# EAGLE design hot-plate_PID_v1.0 (EAGLE 6.2)

## Sheet 1 of 4
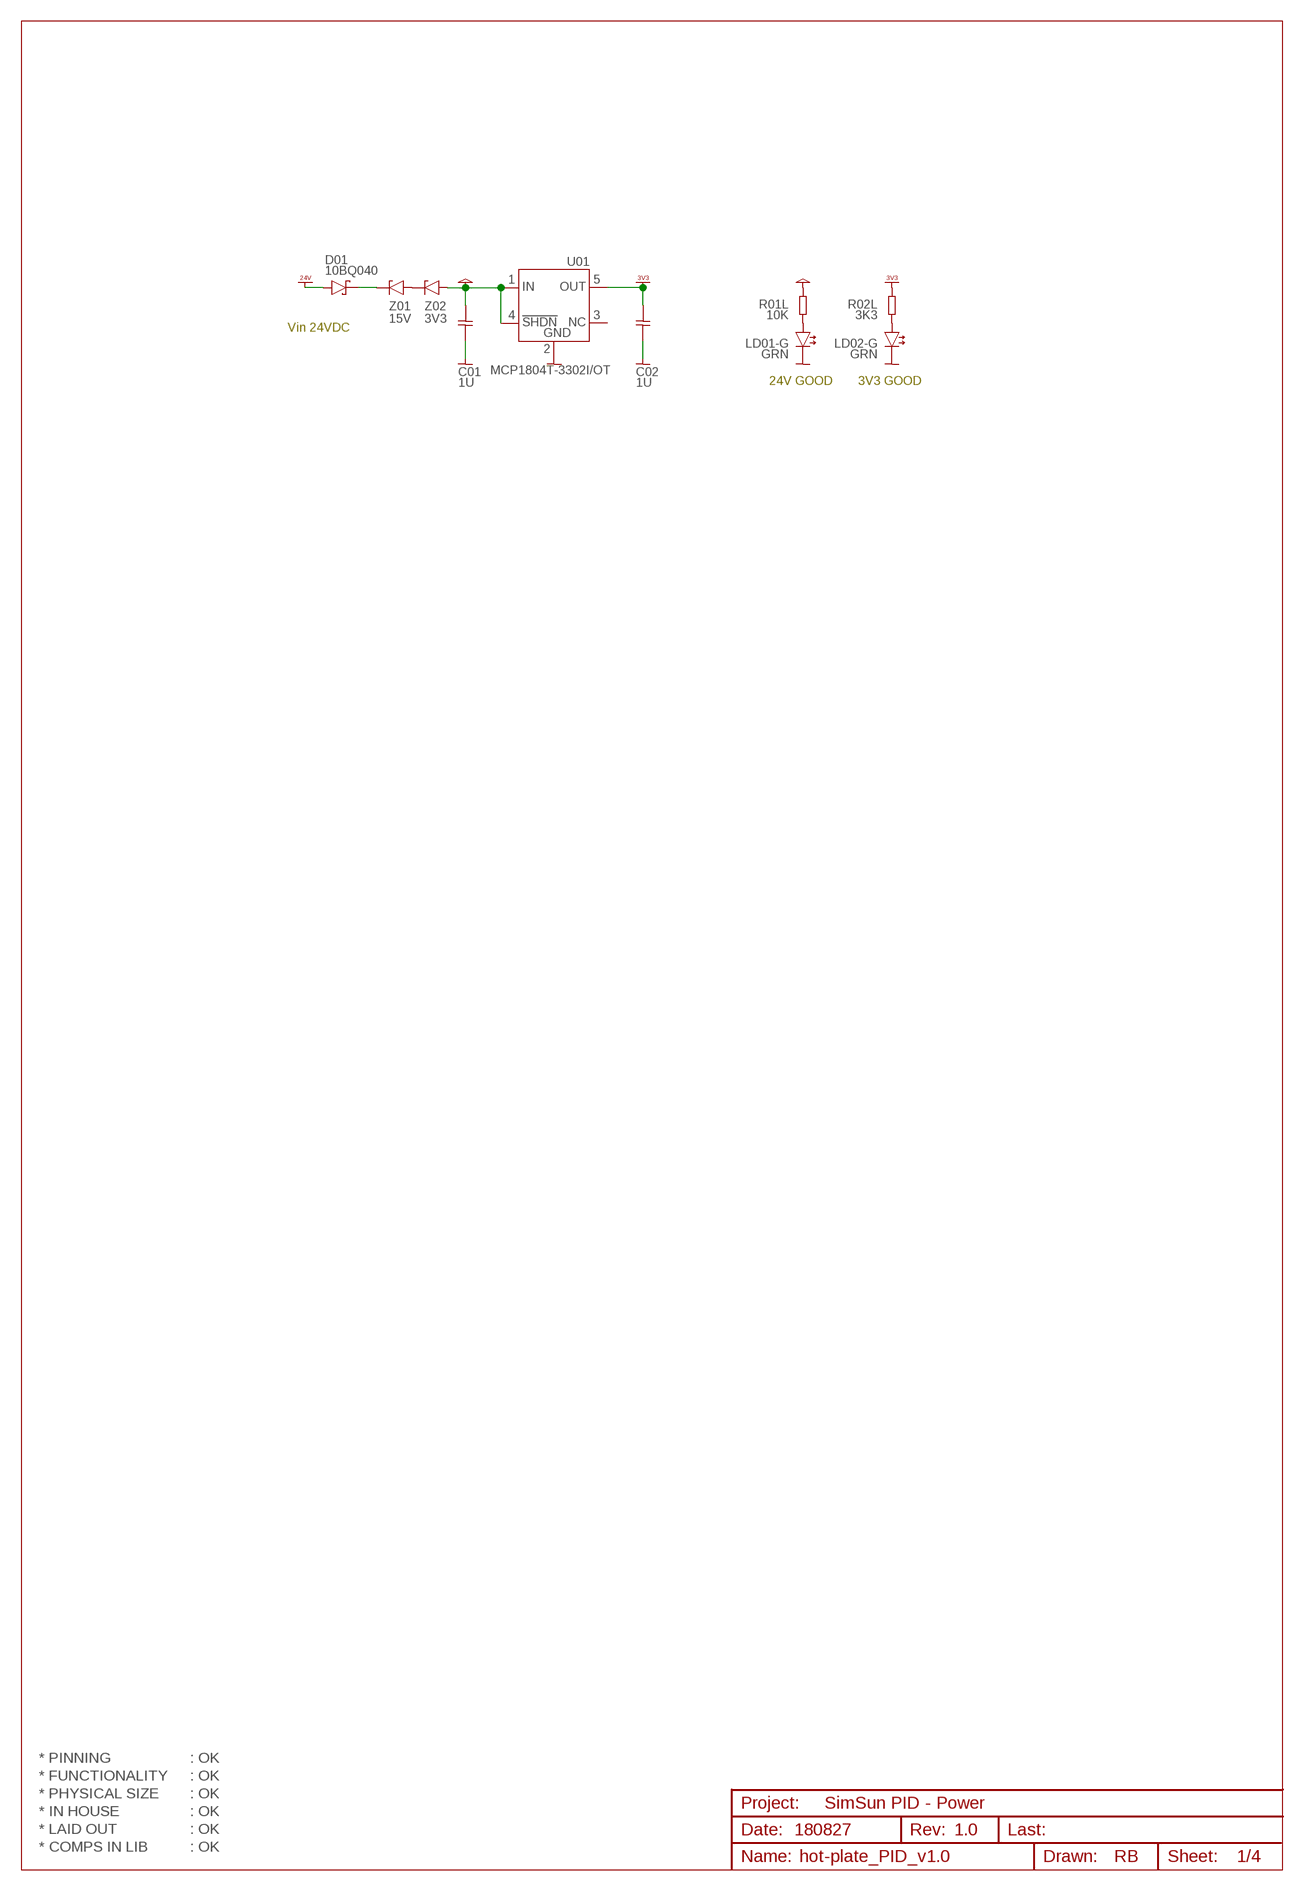
[diagram p0: schematic, sheet 1]

### Parts
C01  1U  CAP0603  [CAP0603]
C02  1U  CAP0603  [CAP0603]
D01  10BQ040  DIODE_15MQ040  [DIODE_SMA]
LD01-G  GRN  LED_SMD_0603  [LED_SMD_0603]
LD02-G  GRN  LED_SMD_0603  [LED_SMD_0603]
R01L  10K  RES0603  [RES0603]
R02L  3K3  RES0603  [RES0603]
U01  MCP1804T-3302I/OT  [SOT23-5]
Z01  15V  ZENER_SOD80  [ZENER_SOD80]
Z02  3V3  ZENER_SOD80  [ZENER_SOD80]

### Nets
GND: C01.2 C02.2 LD01-G.C LD02-G.C U01.2(2.GND) ; also sheet 2,3,4
N$3: LD02-G.A R02L.2
N$25: LD01-G.A R01L.2
N$151: D01.C(-) Z01.2(-)
N$162: Z01.1(+) Z02.2(-)
VCC: C01.1 R01L.1 U01.1(1.IN) U01.4(4.SHDN) Z02.1(+)
VDD_3V3: C02.1 R02L.1 U01.5(5.OUT) ; supply symbol labelled VCC_3V3 ; also sheet 2,4
VDD_24V: D01.A(+) ; supply symbol labelled VCC_24V ; also sheet 2,3
Unconnected: U01.3(3.NC)

### Notes on the sheet
- Vin 24VDC
- 24V GOOD | 3V3 GOOD
- * PINNING | : OK
- * FUNCTIONALITY | : OK
- * PHYSICAL SIZE | : OK
- SimSun PID - Power
- * IN HOUSE | : OK
- * LAID OUT | : OK | 180827 | 1.0
- * COMPS IN LIB | : OK

## Sheet 2 of 4
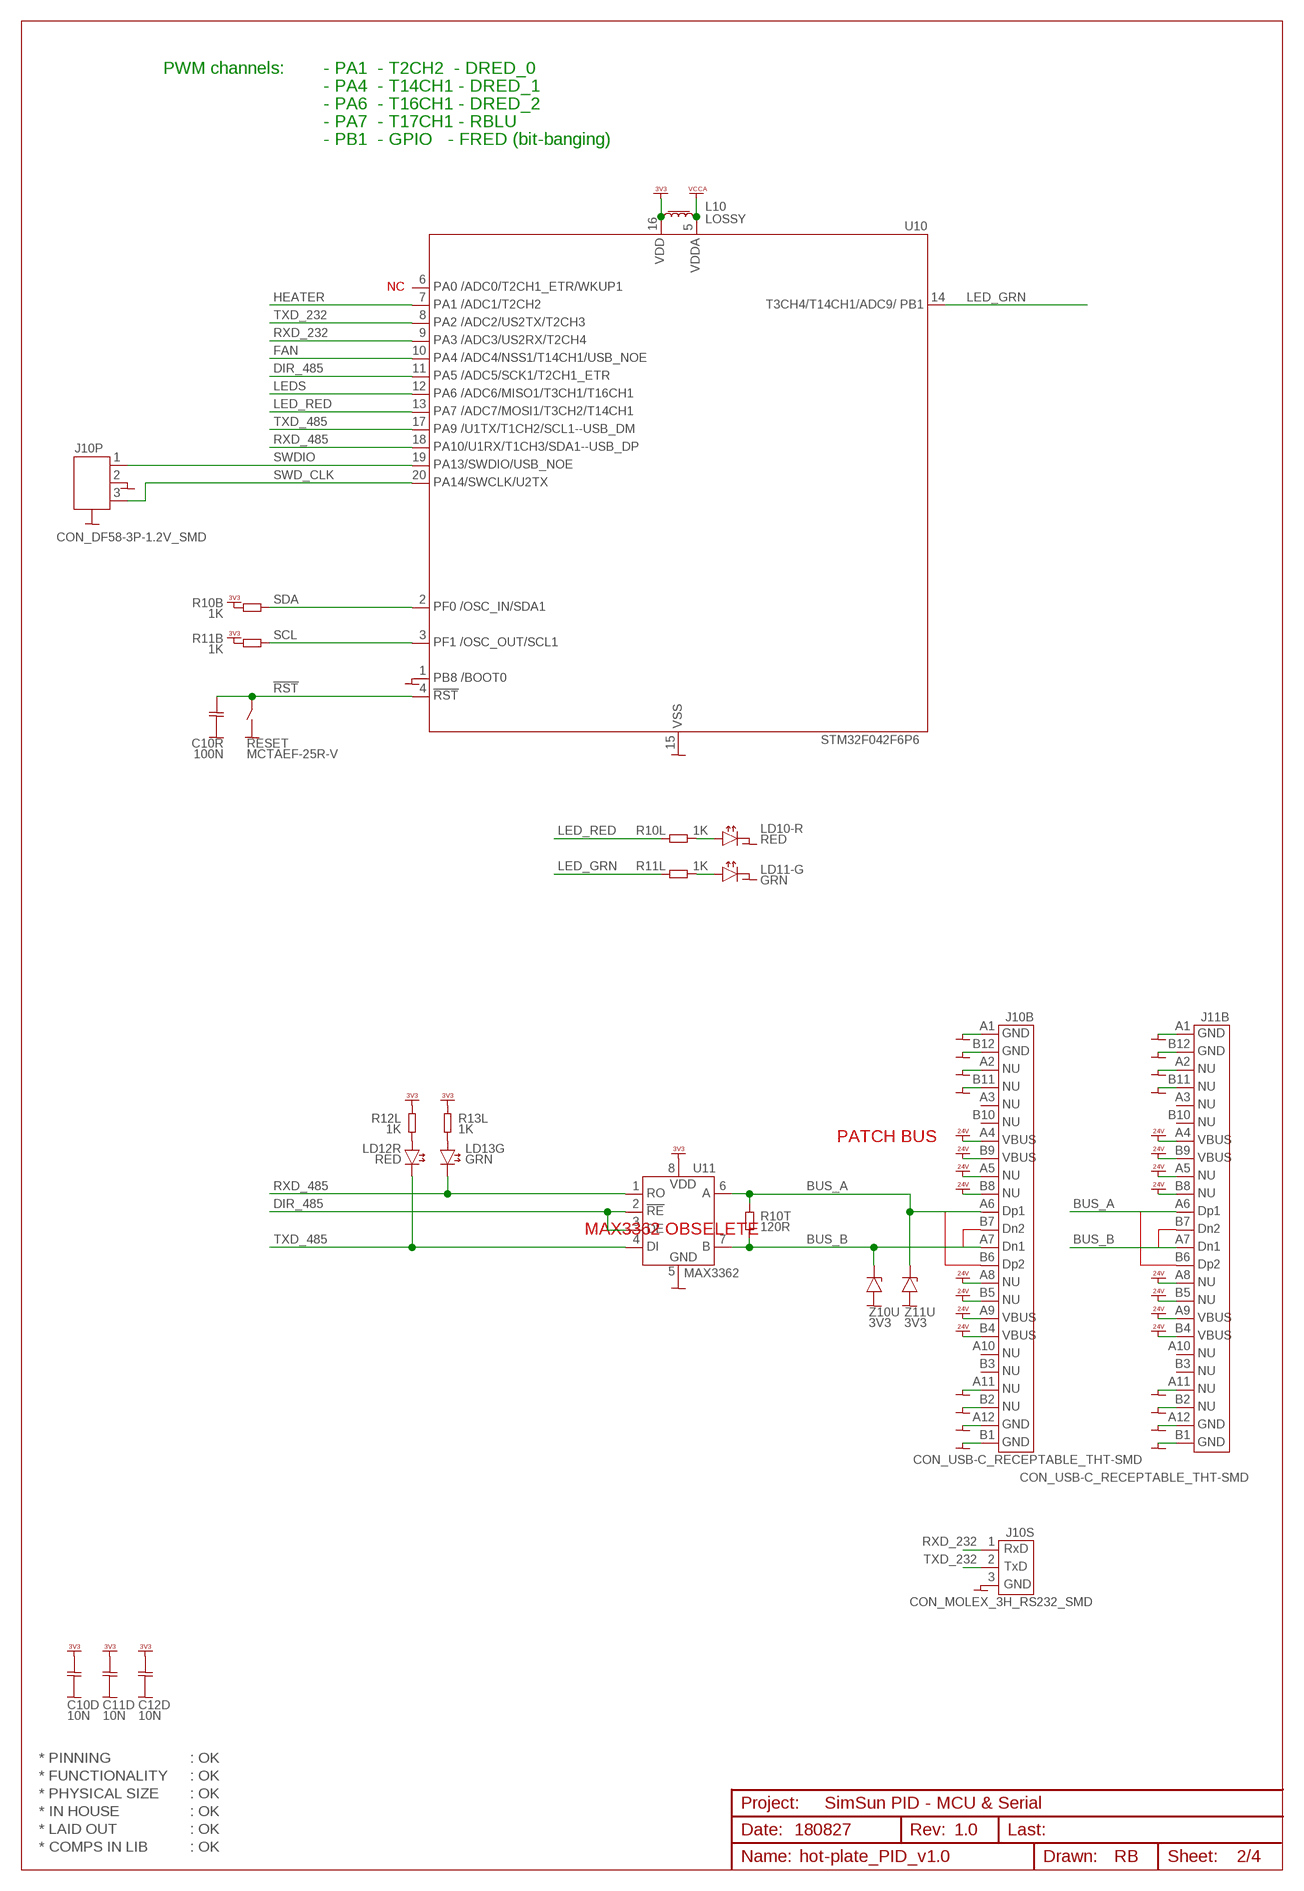
[diagram p1: schematic, sheet 2]

### Parts
C10D  10N  CAP0603  [CAP0603]
C10R  100N  CAP0603  [CAP0603]
C11D  10N  CAP0603  [CAP0603]
C12D  10N  CAP0603  [CAP0603]
J10B  CON_USB-C_RECEPTABLE_THT-SMD  [CON_USB-C_RECEPTABLE_THT-SMD]
J10P  CON_DF58-3P-1.2V_SMD  [CON_DF58-3P-1.2V_SMD]
J10S  CON_MOLEX_3H_RS232_SMD  [CON_MOLEX_3H+SMD]
J11B  CON_USB-C_RECEPTABLE_THT-SMD  [CON_USB-C_RECEPTABLE_THT-SMD]
L10  LOSSY  L_0603  [L_0603]
LD10-R  RED  LED_SMD_0603  [LED_SMD_0603]
LD11-G  GRN  LED_SMD_0603  [LED_SMD_0603]
LD12R  RED  LED_SMD_0603  [LED_SMD_0603]
LD13G  GRN  LED_SMD_0603  [LED_SMD_0603]
R10B  1K  RES0603  [RES0603]
R10L  1K  RES0603  [RES0603]
R10T  120R  RES0603  [RES0603]
R11B  1K  RES0603  [RES0603]
R11L  1K  RES0603  [RES0603]
R12L  1K  RES0603  [RES0603]
R13L  1K  RES0603  [RES0603]
RESET  MCTAEF-25R-V  SWITCH_PUSHBUTTON  [SWITCH_SMD_PBUTTON_2P]
U10  STM32F042F6P6  [TSSOP20]
U11  MAX3362  [SOT23-8]
Z10U  3V3  ZENER_SOD80  [ZENER_SOD80]
Z11U  3V3  ZENER_SOD80  [ZENER_SOD80]

### Nets
!RST: C10R.1 RESET.2(3-4) U10.4(4.!RST)
BUS_A: J10B.A6(A6.DP1) J11B.A6(A6.DP1) R10T.1 U11.6(6.A) Z11U.2(-)
BUS_B: J10B.A7(A7.DN1) J11B.A7(A7.DN1) R10T.2 U11.7(7.B) Z10U.2(-)
DIR_485: U10.11(11.PA5) U11.2(2.!RE) U11.3(3.DE)
FAN: U10.10(10.PA4) ; also sheet 3
GND: C10D.2 C10R.2 C11D.2 C12D.2 J10B.A1(A1.GND) J10B.A2(A2.NU) J10B.A11(A11.NU) J10B.A12(A12.GND) J10B.B1(B1.GND) J10B.B2(B2.NU) J10B.B11(B11.NU) J10B.B12(B12.GND) J10P.2 J10P.GND1 J10P.GND2 J10S.3 J11B.A1(A1.GND) J11B.A2(A2.NU) J11B.A11(A11.NU) J11B.A12(A12.GND) J11B.B1(B1.GND) J11B.B2(B2.NU) J11B.B11(B11.NU) J11B.B12(B12.GND) LD10-R.C LD11-G.C RESET.1(1-2) U10.1(1.BOOT0) U10.15(15.GND) U11.5(5.GND) Z10U.1(+) Z11U.1(+) ; also sheet 1,3,4
HEATER: U10.7(7.PA1) ; also sheet 3
LED_GRN: R11L.1 U10.14(14.PB1)
LED_RED: R10L.1 U10.13(13.PA7)
LEDS: U10.12(12.PA6) ; also sheet 3
N$148: LD11-G.A R11L.2
N$149: LD10-R.A R10L.2
N$152: LD13G.A R13L.2
N$153: LD12R.A R12L.2
RXD_232: J10S.1 U10.9(9.PA3)
RXD_485: LD13G.C U10.18(18.PA10) U11.1(1.RO)
SCL: R11B.2 U10.3(3.OSC_OUT) ; also sheet 4
SDA: R10B.2 U10.2(2.OSC_IN) ; also sheet 4
SWD_CLK: J10P.3 U10.20(20.PA14)
SWDIO: J10P.1 U10.19(19.PA13)
TXD_232: J10S.2 U10.8(8.PA2)
TXD_485: LD12R.C U10.17(17.PA9) U11.4(4.DI)
VCCA: L10.2 U10.5(5.VDDA)
VDD_3V3: C10D.1 C11D.1 C12D.1 L10.1 R10B.1 R11B.1 R12L.1 R13L.1 U10.16(16.VDD) U11.8(8.VDD) ; supply symbol labelled VCC_3V3 ; also sheet 1,4
VDD_24V: J10B.A4(A4.VBUS) J10B.A5(A5.NU) J10B.A8(A8.NU) J10B.A9(A9.VBUS) J10B.B4(B4.VBUS) J10B.B5(B5.NU) J10B.B8(B8.NU) J10B.B9(B9.VBUS) J11B.A4(A4.VBUS) J11B.A5(A5.NU) J11B.A8(A8.NU) J11B.A9(A9.VBUS) J11B.B4(B4.VBUS) J11B.B5(B5.NU) J11B.B8(B8.NU) J11B.B9(B9.VBUS) ; supply symbol labelled VCC_24V ; also sheet 1,3
Unconnected: J10B.A3(A3.NU) J10B.A10(A10.NU) J10B.B3(B3.NU) J10B.B6(B6.DP2) J10B.B7(B7.DN2) J10B.B10(B10.NU) J11B.A3(A3.NU) J11B.A10(A10.NU) J11B.B3(B3.NU) J11B.B6(B6.DP2) J11B.B7(B7.DN2) J11B.B10(B10.NU) U10.6(6.PA0)

### Notes on the sheet
- PWM channels: | - PA1  - T2CH2  - DRED_0
- - PA4  - T14CH1 - DRED_1
- - PA6  - T16CH1 - DRED_2
- - PA7  - T17CH1 - RBLU
- - PB1  - GPIO   - FRED (bit-banging)
- NC
- PATCH BUS
- MAX3362 OBSELETE
- * PINNING | : OK
- * FUNCTIONALITY | : OK
- * PHYSICAL SIZE | : OK
- SimSun PID - MCU & Serial
- * IN HOUSE | : OK
- * LAID OUT | : OK | 180827 | 1.0
- * COMPS IN LIB | : OK

## Sheet 3 of 4
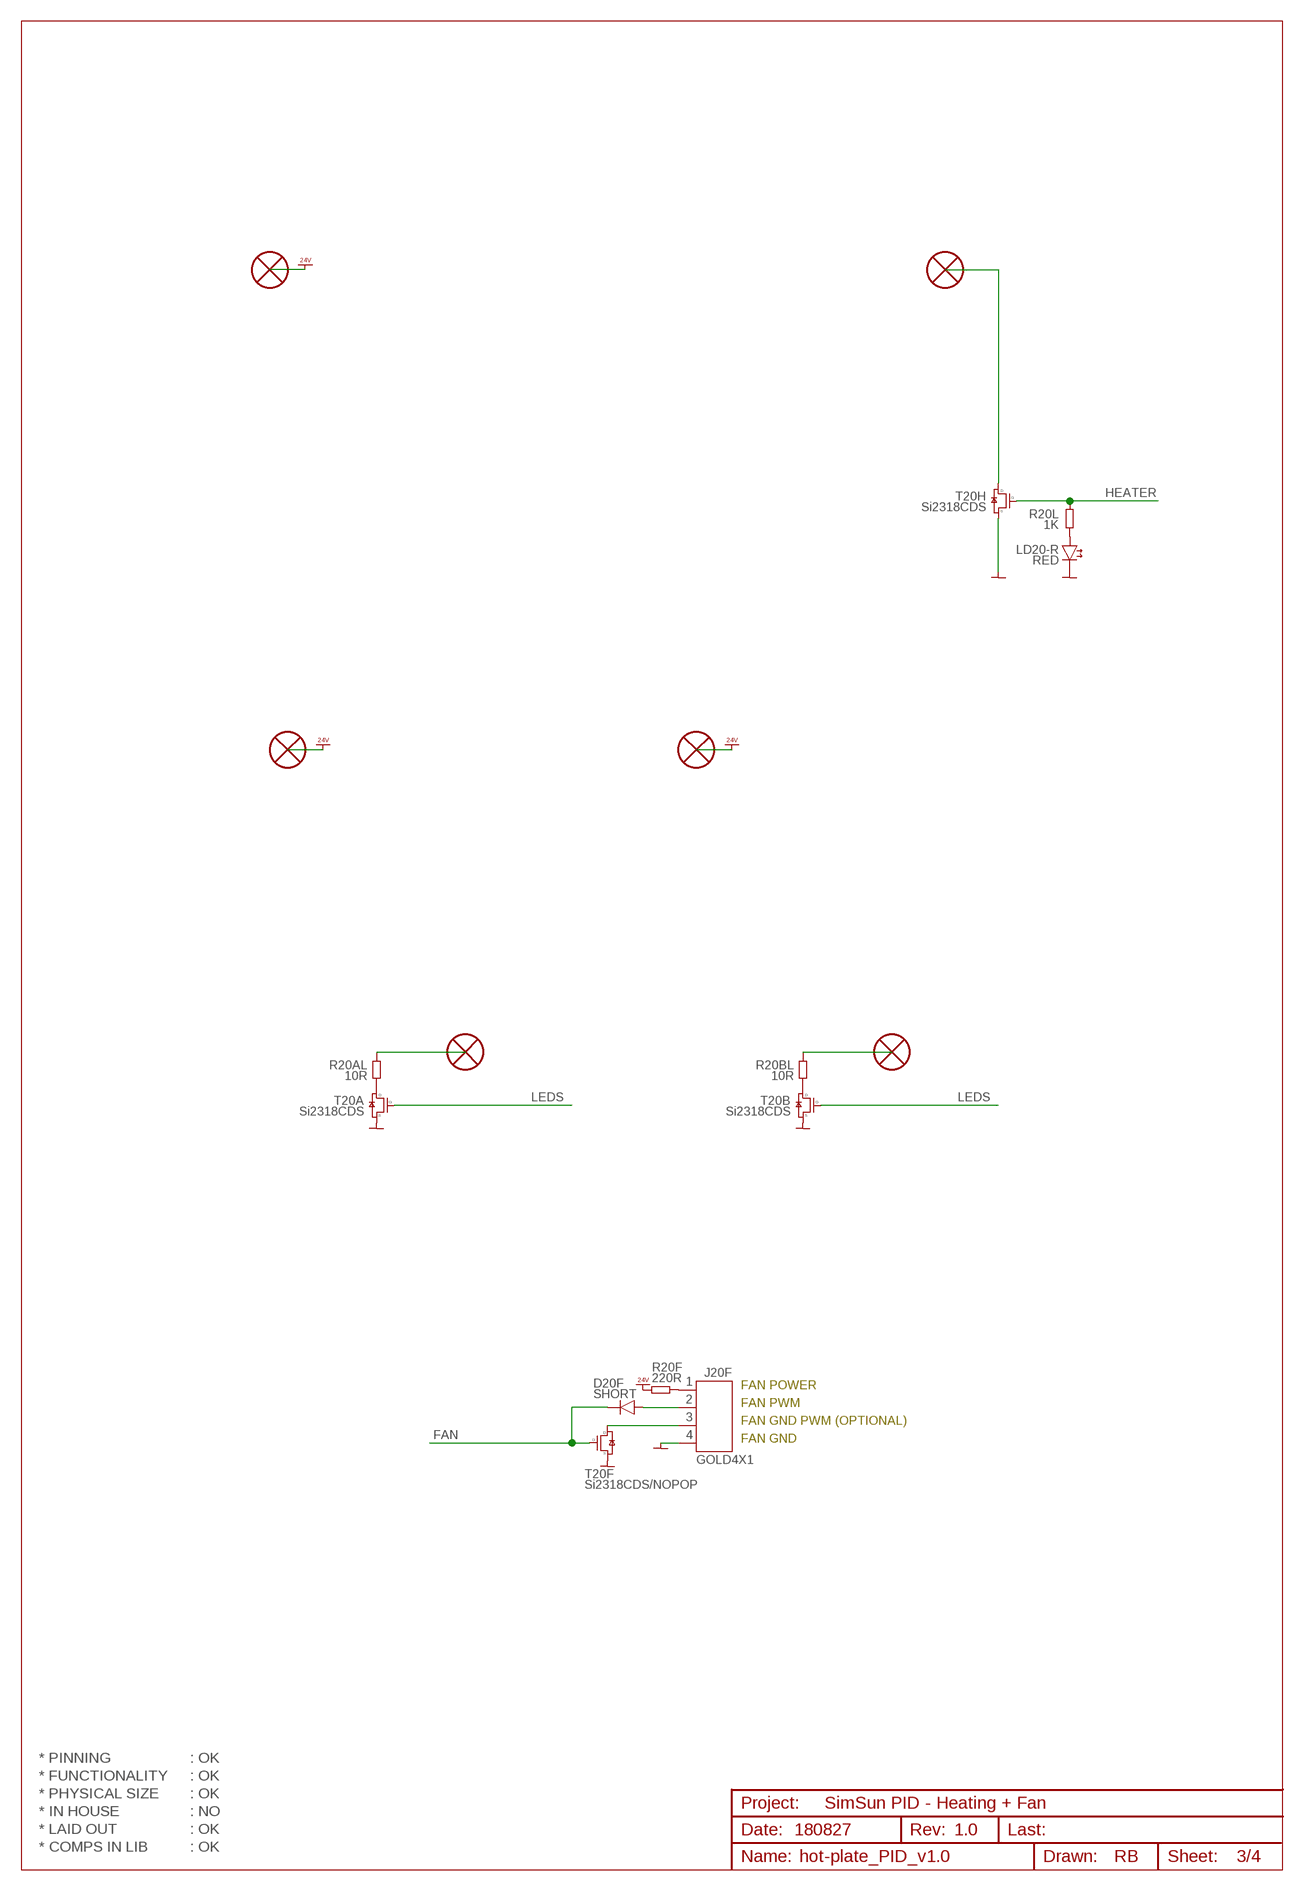
[diagram p2: schematic, sheet 3]

### Parts
D20F  SHORT  DIODE_1N4148WS  [DIODE_SOD323]
H5  HOLE_PTH_1.0MM  [HOLE_PTH_1.0MM]
H6  HOLE_PTH_1.0MM  [HOLE_PTH_1.0MM]
H10  HOLE_PTH_1.0MM  [HOLE_PTH_1.0MM]
H15  HOLE_PTH_1.0MM  [HOLE_PTH_1.0MM]
H16  HOLE_PTH_1.0MM  [HOLE_PTH_1.0MM]
H17  HOLE_PTH_1.0MM  [HOLE_PTH_1.0MM]
J20F  GOLD4X1  [GOLD4X1]
LD20-R  RED  LED_SMD_0603  [LED_SMD_0603]
R20AL  10R  RES0603  [RES0603]
R20BL  10R  RES0603  [RES0603]
R20F  220R  RES0603  [RES0603]
R20L  1K  RES0603  [RES0603]
T20A  Si2318CDS  NFET_SOT23  [NFET_SOT23]
T20B  Si2318CDS  NFET_SOT23  [NFET_SOT23]
T20F  Si2318CDS/NOPOP  NFET_SOT23  [NFET_SOT23]
T20H  Si2318CDS  NFET_SOT23  [NFET_SOT23]

### Nets
FAN: D20F.1-(-) T20F.1(G1) ; also sheet 2
GND: J20F.4 LD20-R.C T20A.2(S2) T20B.2(S2) T20F.2(S2) T20H.2(S2) ; also sheet 1,2,4
HEATER: R20L.1 T20H.1(G1) ; also sheet 2
LEDS: T20A.1(G1) T20B.1(G1) ; also sheet 2
N$4: J20F.1 R20F.1
N$69: H5.1 T20H.3(D3)
N$70: LD20-R.A R20L.2
N$85: H16.1 R20BL.1
N$86: H17.1 R20AL.1
N$87: R20AL.2 T20A.3(D3)
N$88: R20BL.2 T20B.3(D3)
N$89: J20F.3 T20F.3(D3)
N$90: D20F.2(+) J20F.2
VDD_24V: H6.1 H10.1 H15.1 R20F.2 ; supply symbol labelled VCC_24V ; also sheet 1,2

### Notes on the sheet
- FAN POWER
- FAN PWM
- FAN GND PWM (OPTIONAL)
- FAN GND
- * PINNING | : OK
- * FUNCTIONALITY | : OK
- * PHYSICAL SIZE | : OK
- SimSun PID - Heating + Fan
- * IN HOUSE | : NO
- * LAID OUT | : OK | 180827 | 1.0
- * COMPS IN LIB | : OK

## Sheet 4 of 4
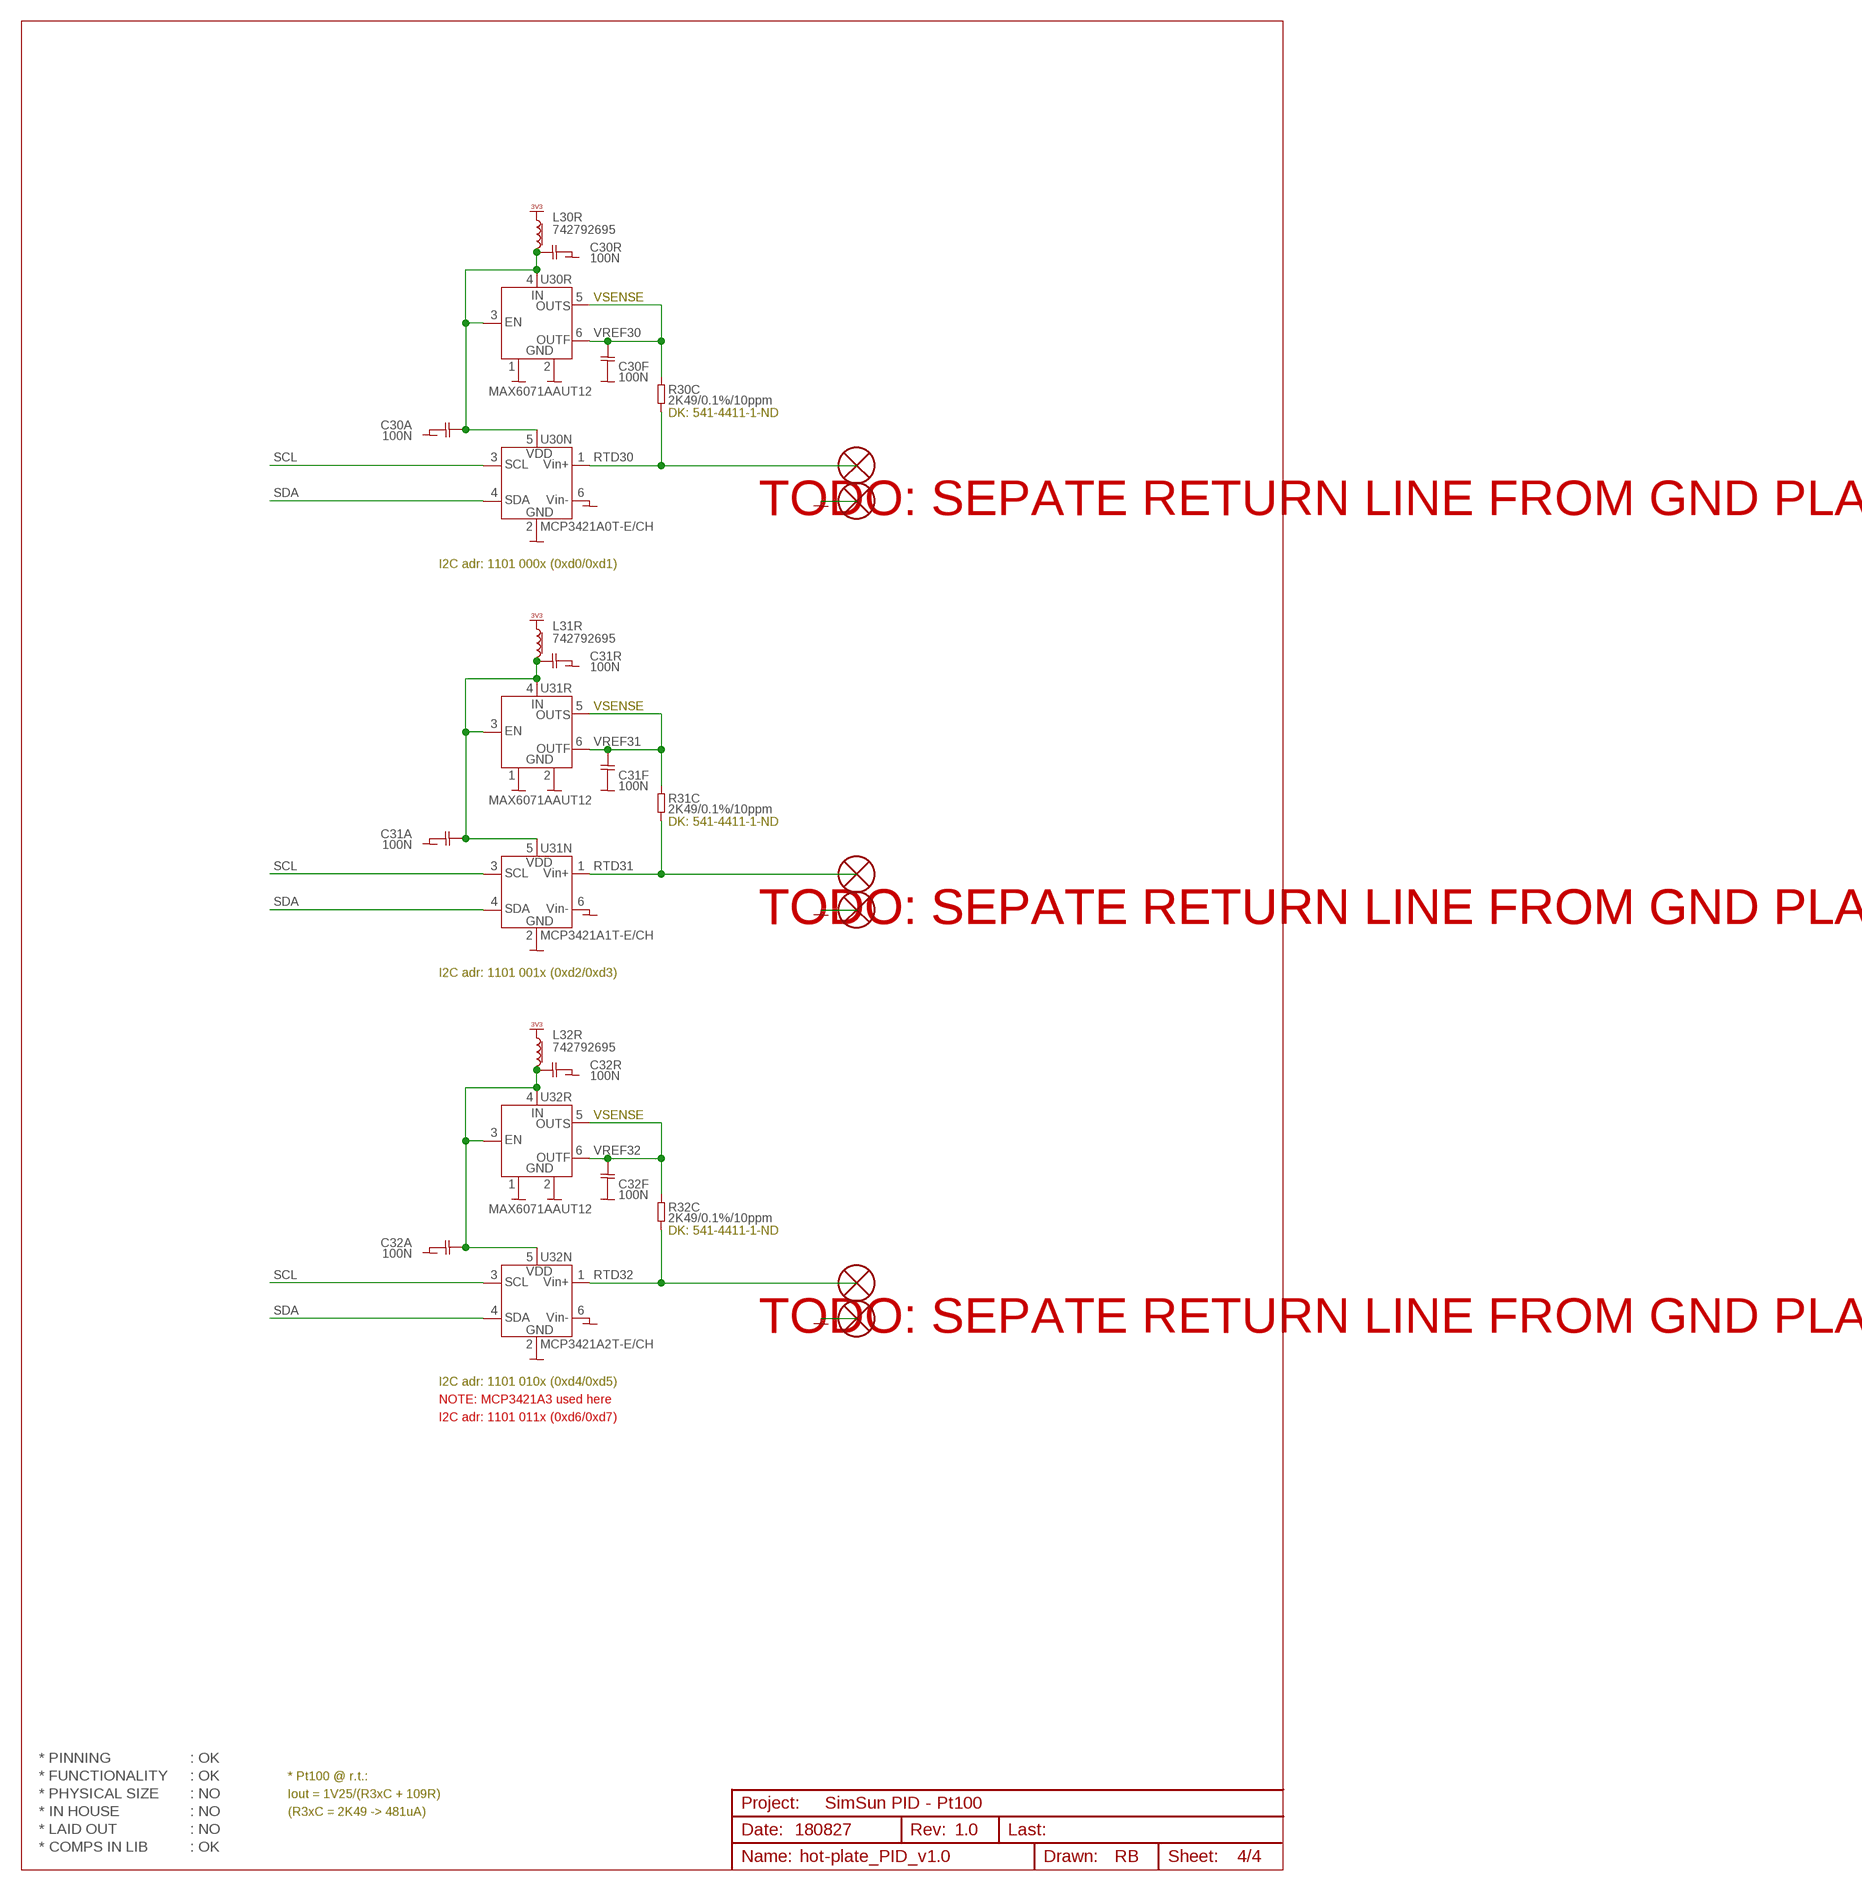
[diagram p3: schematic, sheet 4]

### Parts
C30A  100N  CAP0603  [CAP0603]
C30F  100N  CAP0603  [CAP0603]
C30R  100N  CAP0603  [CAP0603]
C31A  100N  CAP0603  [CAP0603]
C31F  100N  CAP0603  [CAP0603]
C31R  100N  CAP0603  [CAP0603]
C32A  100N  CAP0603  [CAP0603]
C32F  100N  CAP0603  [CAP0603]
C32R  100N  CAP0603  [CAP0603]
H7  HOLE_PTH_1.0MM  [HOLE_PTH_1.0MM]
H8  HOLE_PTH_1.0MM  [HOLE_PTH_1.0MM]
H11  HOLE_PTH_1.0MM  [HOLE_PTH_1.0MM]
H12  HOLE_PTH_1.0MM  [HOLE_PTH_1.0MM]
H13  HOLE_PTH_1.0MM  [HOLE_PTH_1.0MM]
H14  HOLE_PTH_1.0MM  [HOLE_PTH_1.0MM]
L30R  742792695  L_0603  [L_0603]
L31R  742792695  L_0603  [L_0603]
L32R  742792695  L_0603  [L_0603]
R30C  2K49/0.1%/10ppm  RES0603  [RES0603]
R31C  2K49/0.1%/10ppm  RES0603  [RES0603]
R32C  2K49/0.1%/10ppm  RES0603  [RES0603]
U30N  MCP3421A0T-E/CH  [SOT23-6]
U30R  MAX6071AAUT12  [SOT23-6]
U31N  MCP3421A1T-E/CH  [SOT23-6]
U31R  MAX6071AAUT12  [SOT23-6]
U32N  MCP3421A2T-E/CH  [SOT23-6]
U32R  MAX6071AAUT12  [SOT23-6]

### Nets
GND: C30A.1 C30F.1 C30R.1 C31A.1 C31F.1 C31R.1 C32A.1 C32F.1 C32R.1 H8.1 H12.1 H14.1 U30N.2(2.VSS) U30N.6(6.VIN-) U30R.1(1.GND) U30R.2(2.GND) U31N.2(2.VSS) U31N.6(6.VIN-) U31R.1(1.GND) U31R.2(2.GND) U32N.2(2.VSS) U32N.6(6.VIN-) U32R.1(1.GND) U32R.2(2.GND) ; also sheet 1,2,3
N$1: C31A.2 C31R.2 L31R.2 U31N.5(5.VDD) U31R.3(3.EN) U31R.4(4.IN)
N$2: C32A.2 C32R.2 L32R.2 U32N.5(5.VDD) U32R.3(3.EN) U32R.4(4.IN)
N$13: C30A.2 C30R.2 L30R.2 U30N.5(5.VDD) U30R.3(3.EN) U30R.4(4.IN)
RTD30: H7.1 R30C.2 U30N.1(1.VIN+)
RTD31: H11.1 R31C.2 U31N.1(1.VIN+)
RTD32: H13.1 R32C.2 U32N.1(1.VIN+)
SCL: U30N.3(3.SCL) U31N.3(3.SCL) U32N.3(3.SCL) ; also sheet 2
SDA: U30N.4(4.SDA) U31N.4(4.SDA) U32N.4(4.SDA) ; also sheet 2
VDD_3V3: L30R.1 L31R.1 L32R.1 ; supply symbol labelled VCC_3V3 ; also sheet 1,2
VREF30: C30F.2 R30C.1 U30R.5(5.OUTS) U30R.6(6.OUTF)
VREF31: C31F.2 R31C.1 U31R.5(5.OUTS) U31R.6(6.OUTF)
VREF32: C32F.2 R32C.1 U32R.5(5.OUTS) U32R.6(6.OUTF)

### Notes on the sheet
- VSENSE
- DK: 541-4411-1-ND
- TODO: SEPATE RETURN LINE FROM GND PLANE
- I2C adr: 1101 000x (0xd0/0xd1)
- VSENSE
- DK: 541-4411-1-ND
- TODO: SEPATE RETURN LINE FROM GND PLANE | TODO: SEPATE RETURN LINE FROM GND PLANE
- I2C adr: 1101 001x (0xd2/0xd3)
- VSENSE
- DK: 541-4411-1-ND
- TODO: SEPATE RETURN LINE FROM GND PLANE
- I2C adr: 1101 010x (0xd4/0xd5)
- NOTE: MCP3421A3 used here
- I2C adr: 1101 011x (0xd6/0xd7)
- * PINNING | : OK
- * FUNCTIONALITY | : OK | * Pt100 @ r.t.:
- * PHYSICAL SIZE | : NO | Iout = 1V25/(R3xC + 109R)
- SimSun PID - Pt100
- * IN HOUSE | : NO | (R3xC = 2K49 -> 481uA)
- * LAID OUT | : NO | 180827 | 1.0
- * COMPS IN LIB | : OK

## Library data of the parts
C01 C02 C10D C10R C11D C12D C30A C30F C30R C31A C31F C31R C32A C32F C32R = 00-own_parts:CAP0603: Capacitor, ceramic, 0603
D01 = 00-own_parts:DIODE_15MQ040: Diode, Schottky, 15MQ040, 40V/3A, SMA, F# 165-1114
D20F = 00-own_parts:DIODE_1N4148WS: Diode, 1N4148WS, high speed, 100V/350mA, SOD323
H5-H8 H10-H17 = 00-own_parts:HOLE_PTH_1.0MM: Hole, PTH, 1.0mm
J10B J11B = 00-own_parts:CON_USB-C_RECEPTABLE_THT-SMD: Connector, DB25, male, straight, wirewarp, press nuts, DK#: 2625FA-ND
J10P = 00-own_parts:CON_DF58-3P-1.2V_SMD: Connector, DF58, 3 way, 1,2mm pitch, SMD
J10S = 00-own_parts:CON_MOLEX_3H_RS232_SMD: Connector, RS232, 3p, SMD pads
J20F = 00-own_parts:GOLD4X1: Header, gold fingers, 0.1", 4x1
L10 L30R L31R L32R = 00-own_parts:L_0603: Inductor, 0603, chip ferrite bead
LD01-G LD02-G LD10-R LD11-G LD12R LD13G LD20-R = 00-own_parts:LED_SMD_0603: LED, SMD, 0603
R01L R02L R10B R10L R10T R11B R11L R12L R13L R20AL R20BL R20F R20L R30C R31C R32C = 00-own_parts:RES
RESET = 00-own_parts:SWITCH_PUSHBUTTON: Switch, push button, SPNO, MCTAEF, F# 160-5485
T20A T20B T20F T20H = 00-own_parts:NFET_SOT23: n-FET, generic SOT23
U01 = 00-own_parts:MCP1804T-3302I/OT: Regulator, LDO w. enable, Vin=2.0..28V, Vout=3V3, Vdrop = 260mV, SOT23-5,
U10 = 00-own_parts:STM32F042F6P6: MCU, low power, ARM Cortex M0, 32-bit, 48 MHz, 32 kB Flash, 6 kB SRAM, 8 kB EEPROM, RTC, xtal-less USB, ADC, cap. touch sensing, TSSOP20
U11 = 00-own_parts:MAX3362: Transceiver, RS485/422, 3V3, SOT23-8
U30N = 00-own_parts:MCP3421A0T-E/CH: ADC, 18-bit sigma-delta, diff. input, w. PGA, internal reference, I2C address 0, SOT23-6, F#160-5567
U30R U31R U32R = 00-own_parts:MAX6071AAUT12: Reference, with enable, 1V25, low noise, 0.04% tol., 6ppm.oC, 10mA SOT23-6
U31N = 00-own_parts:MCP3421A1T-E/CH: ADC, 18-bit sigma-delta, diff. input, w. PGA, internal reference, I2C address 1, SOT23-6
U32N = 00-own_parts:MCP3421A2T-E/CH: ADC, 18-bit sigma-delta, diff. input, w. PGA, internal reference, I2C address 2, SOT23-6
Z01 Z02 Z10U Z11U = 00-own_parts:ZENER_SOD80: Zener, generic SOD80

## Board
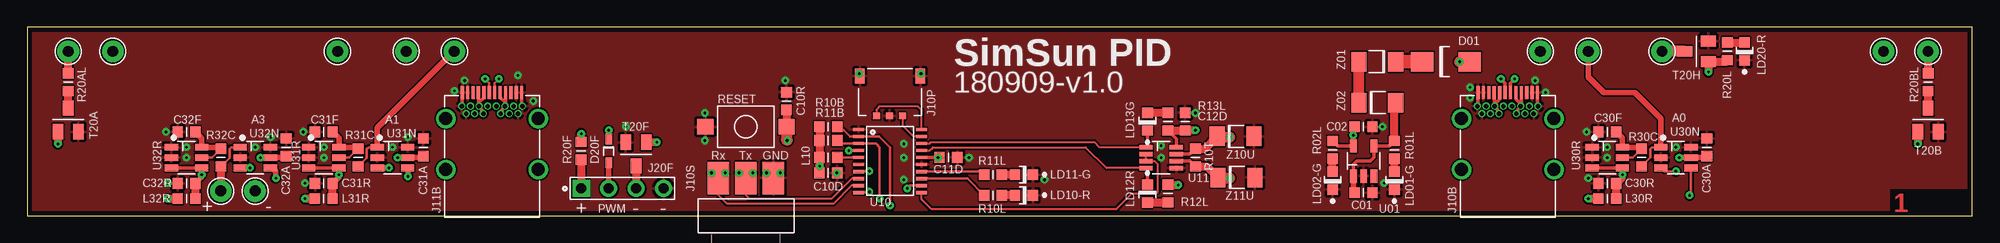
[diagram p4: board, top side]
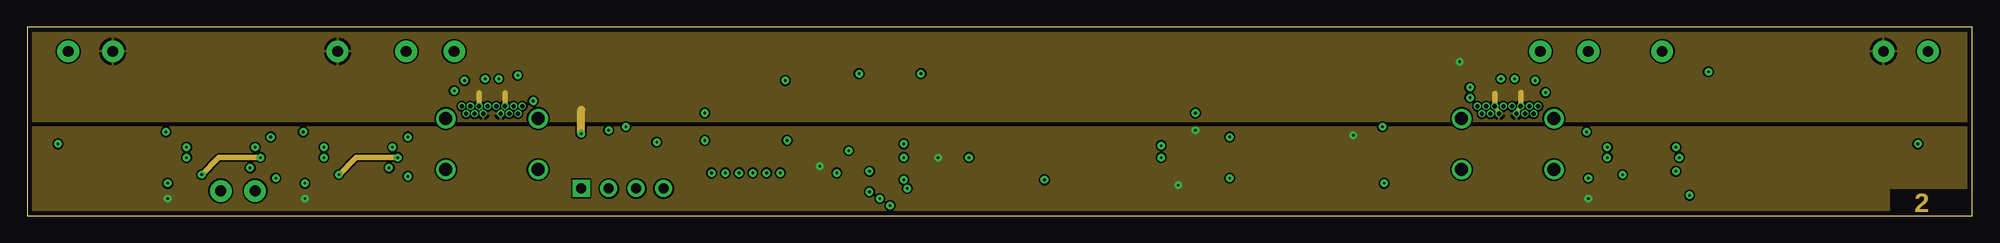
[diagram p5: board, inner layer Route2]
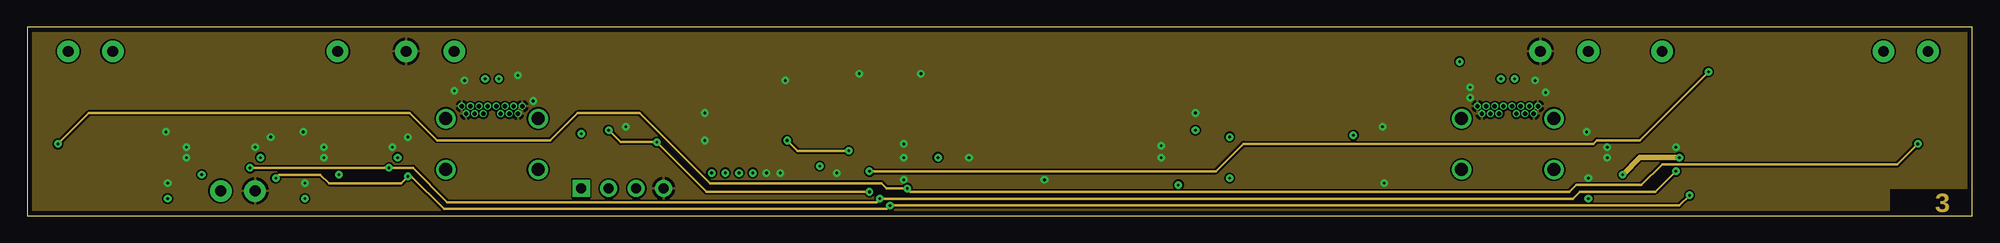
[diagram p6: board, inner layer Route15]
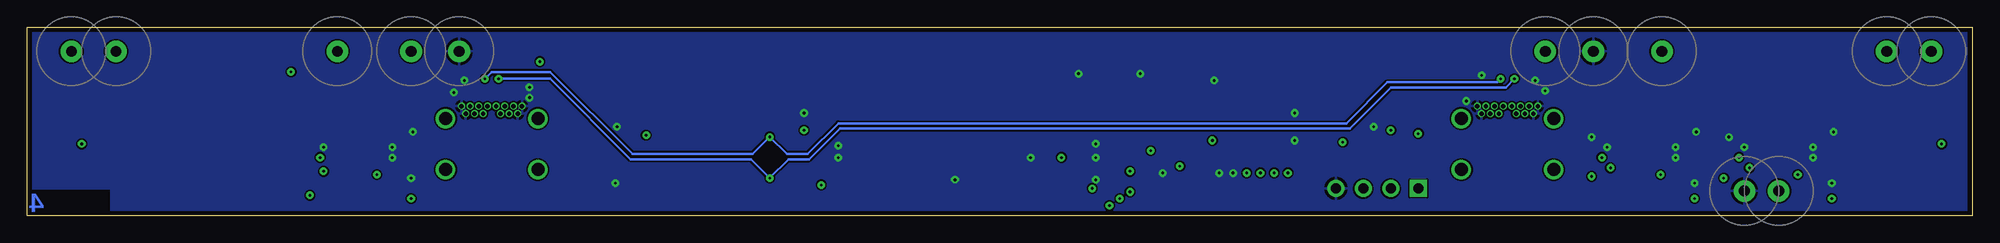
[diagram p7: board, bottom side, seen from below]

Size 180 x 17.5 mm. Coordinates in mm from the lower left corner, seen from the top.
Outline: 180,0 180,17.5 0,17.5 0,0 180,0
Copper layers (1*2+15*16): Top 0.018mm / dielectric 0.4mm / Route2 0.035mm / dielectric 0.71mm / Route15 0.035mm / dielectric 0.4mm / Bottom 0.018mm
Design rules: minimum track width 0.15mm, minimum drill 0.25mm, track to track 0.15mm, track to pad 0.15mm, pad to pad 0.15mm, via to via 0.15mm, smd to smd 0mil, copper to edge 0.45mm, drill to drill 0.3mm, minimum pad ring 0.125mm, minimum via ring 0.2mm, stop-mask expansion 0.1mm, vias tented up to drill 0.4mm, thermal gap 10mil

### Footprints (pad centres in the part's own frame; a part is rotated, then mirrored left to right if it is on the bottom)
CAP0603 = smd 0.95 x 1: 1 -0.821,0.002; 2 0.822,0
DIODE_SMA = smd 2.1 x 1.8: A -2.2,0; C 2.2,0
DIODE_SOD323 = smd 1 x 0.6: 1- -1.1,0; 2 1.1,0
HOLE_PTH_1.0MM = drill 1 pad 2: 1 0,0
CON_USB-C_RECEPTABLE_THT-SMD = smd 0.3 x 1.2: A1 -2.75,1.25; A2 -2.25,1.25; A3 -1.75,1.25; A4 -1.25,1.25; A5 -0.75,1.25; A6 -0.25,1.25; A7 0.25,1.25; A8 0.75,1.25; A9 1.25,1.25; A10 1.75,1.25; A11 2.25,1.25; A12 2.75,1.25 | drill 0.4 pad 0.65: B1 2.8,0; B2 2.4,-0.7; B3 1.6,-0.7; B4 1.2,0; B5 0.8,-0.7; B6 0.4,0; B7 -0.4,0; B8 -0.8,-0.7; B9 -1.2,0; B10 -1.6,-0.7; B11 -2.4,-0.7; B12 -2.8,0; BG1 2,0; BG2 -2,0 | drill 1.2 pad 1.8: C1 -4.27,-5.88; C2 4.27,-5.88; C3 -4.27,-1.15; C4 4.27,-1.15
CON_DF58-3P-1.2V_SMD = smd 0.65 x 0.6: 1 -1.15,4.4; 2 0.05,4.4; 3 1.25,4.4 | smd 0.85 x 1.4: GND1 -2.8,0.7; GND2 2.8,0.7
CON_MOLEX_3H+SMD = smd 2 x 3: 1 -2.54,0; 2 0,0; 3 2.54,0
GOLD4X1 = drill 0.9 pad 1.6 square: 1 -3.81,0 | drill 0.9 pad 1.6: 2 -1.27,0; 3 1.27,0; 4 3.81,0
L_0603 = smd 0.95 x 1: 1 -0.821,0.002; 2 0.822,0
LED_SMD_0603 = smd 0.95 x 1: A -0.827,0; C 0.827,0
RES0603 = smd 0.95 x 1: 1 -0.821,0.002; 2 0.822,0
SWITCH_SMD_PBUTTON_2P = smd 1.5 x 1.4: 1 -3.75,0; 2 3.75,0
NFET_SOT23 = smd 1 x 1.4: 1 -0.95,-1.1; 2 0.95,-1.1; 3 0,1.1
SOT23-5 = smd 0.62 x 1.22: 1 -0.95,-1.4; 2 0,-1.4; 3 0.95,-1.4; 4 0.95,1.4; 5 -0.95,1.4
TSSOP20 = smd 0.305 x 0.991: 1 -2.925,-2.918; 2 -2.275,-2.918; 3 -1.625,-2.918; 4 -0.975,-2.918; 5 -0.325,-2.918; 6 0.325,-2.918; 7 0.975,-2.918; 8 1.625,-2.918; 9 2.275,-2.918; 10 2.925,-2.918; 11 2.925,2.918; 12 2.275,2.918; 13 1.625,2.918; 14 0.975,2.918; 15 0.325,2.918; 16 -0.325,2.918; 17 -0.975,2.918; 18 -1.625,2.918; 19 -2.275,2.918; 20 -2.925,2.918
SOT23-8 = smd 0.4 x 1.22: 1 -0.975,-1.4; 2 -0.325,-1.4; 3 0.325,-1.4; 4 0.975,-1.4; 5 0.975,1.4; 6 0.325,1.4; 7 -0.325,1.4; 8 -0.975,1.4
SOT23-6 = smd 0.62 x 1.22: 1 -0.95,-1.4; 2 0,-1.4; 3 0.95,-1.4; 4 0.95,1.4; 5 0,1.4; 6 -0.95,1.4
ZENER_SOD80 = smd 1.4 x 1.8: 1 -1.7,0; 2 1.7,0

### Placement (x,y rotation side)
C01  123.67,2.14 0 top
C02  123.67,8.25 0 top
C10D  74.14,3.97 0 top
C10R  70.26,10.63 90 top
C11D  85.25,5.39 0 top
C12D  107.16,8.73 90 top
C30A  155.41,6.35 270 top
C30F  146.21,7.78 0 top
C30R  146.21,3.01 0 top
C31A  36.67,6.35 270 top
C31F  27.46,7.78 0 top
C31R  27.46,3.01 0 top
C32A  23.97,6.35 270 top
C32F  14.76,7.78 0 top
C32R  14.76,3.01 0 top
D01  131.28,14.29 180 top
D20F  53.81,6.03 270 top
H5  151.29,15.24 0 top
H6  28.73,15.24 0 top
H7  144.46,15.24 0 top
H8  140.02,15.24 0 top
H10  7.94,15.24 0 top
H11  39.53,15.24 0 top
H12  35.08,15.24 0 top
H13  17.93,2.3 0 top
H14  21.1,2.3 0 top
H15  171.77,15.24 180 top
H16  175.89,15.24 0 top
H17  3.81,15.24 0 top
J10B  137,10.16 0 top
J10P  79.85,13.65 180 top
J10S  66.52,3.49 0 top
J11B  43.02,10.16 0 top
J20F  55.09,2.54 0 top
L10  74.14,5.39 0 top
L30R  146.21,1.59 0 top
L31R  27.46,1.59 0 top
L32R  14.76,1.59 0 top
LD01-G  126.51,3.26 270 top
LD02-G  120.8,3.26 270 top
LD10-R  92.23,1.9 0 top
LD11-G  92.23,3.81 0 top
LD12R  103.66,2.06 90 top
LD13G  103.66,8.73 270 top
LD20-R  158.91,15.24 270 top
R01L  126.51,6.12 270 top
R02L  120.8,6.12 270 top
R10B  74.14,8.25 0 top
R10L  89.38,1.9 0 top
R10T  108.11,5.39 90 top
R11B  74.14,6.98 0 top
R11L  89.38,3.81 0 top
R12L  105.57,2.06 270 top
R13L  105.56,8.73 90 top
R20AL  3.81,12.38 270 top
R20BL  175.89,12.38 270 top
R20F  51.27,6.03 90 top
R20L  157.32,15.24 90 top
R30C  149.38,5.39 270 top
R31C  30.64,5.39 270 top
R32C  17.94,5.39 270 top
RESET  66.52,8.25 0 top
T20A  3.81,8.89 0 top
T20B  175.89,8.89 0 top
T20F  56.35,5.71 180 top
T20H  154.46,15.24 90 top
U01  123.67,5.08 0 top
U10  79.85,5.08 270 top
U11  104.93,5.39 270 top
U30N  152.56,5.39 270 top
U30R  146.21,5.39 270 top
U31N  33.81,5.39 270 top
U31R  27.46,5.39 270 top
U32N  21.11,5.39 270 top
U32R  14.76,5.39 270 top
Z01  124.94,14.29 0 top
Z02  124.94,10.47 180 top
Z10U  111.82,7.36 180 top
Z11U  111.9,3.55 180 top

### Tracks (layer width: path | path; a pad name or v marks a point on that pad's centre or on a via)
!RST  (via drill 0.25 pad 0.7)
  Top 0.203: U10.4 76.06,6.05 v76.04,6.03
  Top 0.762: C10R.1 RESET.2
  Top 1.016: RESET.2 70.27,7.04 v70.33,6.98
  Route15 0.254: v70.33,6.98 71.28,6.03 v76.04,6.03
BUS_A  (via drill 0.25 pad 0.7)
  Top 0.254: J11B.A6 42.77,12.31 v42.38,12.7
  Top 0.305: U11.6 107.61,5.07 R10T.1 | v136.37,12.7 136.75,12.31 J10B.A6
  Top 0.762: R10T.1 109.17,4.57 Z11U.2
  Top 1.016: Z11U.2 110.26,3.49 v111.28,3.49
  Bottom 0.254: v42.38,12.7 43.18,11.9 53.81,11.9 57.62,8.09 104.77,8.09 107.63,5.24 109.54,5.24 v111.28,3.49 113.03,5.24 124.14,5.24 131.6,12.7 v136.37,12.7
BUS_B  (via drill 0.25 pad 0.7)
  Top 0.254: J11B.A7 43.27,12.31 v43.66,12.7
  Top 0.305: U11.7 107.61,5.72 R10T.2 | v137.63,12.7 137.25,12.31 J10B.A7
  Top 0.762: R10T.2 108.97,6.22 Z10U.2
  Top 1.016: Z10U.2 110.18,7.3 v111.28,7.3
  Bottom 0.254: v43.66,12.7 43.97,12.38 54.13,12.38 57.94,8.57 104.93,8.57 107.79,5.71 109.69,5.71 v111.28,7.3 112.87,5.71 123.98,5.71 131.6,13.33 137,13.33 v137.63,12.7
DIR_485
  Top 0.203: U11.2 U11.3 104.3,5.08 104.61,4.76 104.61,2.22 104.46,2.06 102.23,2.06 100.81,0.63 83.66,0.63 82.77,1.52 U10.11
FAN  (via drill 0.25 pad 0.7)
  Top 0.254: U10.10 77.88,2.15 v77.94,2.22
  Top 0.508: T20F.1 57.32,6.82 | v53.81,7.94 D20F.1-
  Top 0.762: 57.32,6.82 v58.26,6.82
  Route15 0.254: v53.81,7.94 54.93,6.82 v58.26,6.82 62.86,2.22 v77.94,2.22
GND  (via drill 0.25 pad 0.7)
  Top 0.305: J10B.A1 134.25,10.27 134.14,10.16 | J10B.A12 139.75,10.27 139.86,10.16 | J11B.A1 40.27,10.27 40.16,10.16 | J11B.A12 45.77,10.27 45.88,10.16
  other vias: 76.99,13.17 82.71,13.17 25.56,7.78 12.86,7.78 55.4,8.25 27.46,6.35 21.11,6.35 144.46,3.49 33.81,6.35 144.3,7.78 62.7,6.98 62.7,9.52 146.21,5.39 152.56,6.35 81.12,6.66 22.54,7.3 68.42,3.97 69.69,3.97 146.21,6.35 104.93,5.39 35.24,7.3 27.46,5.39 14.76,6.35 74.93,3.97 108.11,9.52 87.15,5.39 14.76,5.39 94.14,3.33 13.02,3.01 81.12,5.39 81.12,3.33 104.93,6.51 25.72,3.01 133.51,10.95 140.49,11.43 133.51,11.9 139.54,12.54 39.53,11.59 45.4,13.02 46.83,10.63 40.48,12.54 70.17,12.54 125.41,8.25 125.57,3.01
  pour Top (rank 2): -0.16,0 -0.16,17.46 180.19,17.46 180.19,2.54 172.24,2.54 172.24,0
  pour Route15: -0.16,0 -0.16,17.46 180.02,17.46 180.18,2.54 172.24,2.54 172.24,0
  pour Bottom: -0.16,0 -0.16,17.46 180.02,17.46 180.18,2.54 172.24,2.54 172.24,0
HEATER  (via drill 0.25 pad 0.7)
  Top 0.254: U10.7 77.92,4.1 v77.94,4.12
  Top 0.762: R20L.1 157.19,14.29 T20H.1 155.56,13.34 v155.57,13.33
  Route15 0.254: v77.94,4.12 110.01,4.12 112.55,6.66 144.94,6.66 145.25,6.98 149.22,6.98 v155.57,13.33
LED_GRN
  Top 0.203: R11L.1
  Top 0.254: 88.2,3.45 R11L.1 88.26,4.1 U10.14
LED_RED
  Top 0.203: R10L.1
  Top 0.254: U10.13 87.01,3.45 R10L.1
LEDS  (via drill 0.25 pad 0.7)
  Top 0.254: U10.12 81.7,2.8 v81.44,2.54
  Top 0.762: T20B.1 v174.94,6.67 v174.94,6.66 | T20A.1 v2.86,6.67 v2.86,6.66
  Route15 0.254: v174.94,6.66 173.04,4.76 151.29,4.76 149.38,2.86 143.35,2.86 142.72,2.22 81.75,2.22 v81.44,2.54 79.53,2.54 79.06,3.01 63.18,3.01 56.67,9.52 50.96,9.52 48.42,6.98 37.94,6.98 35.4,9.52 5.71,9.52 v2.86,6.66
N$1  (via drill 0.25 pad 0.7)
  Top 0.305: U31R.3 U31R.4
  Top 0.508: U31R.4 v28.86,3.81 28.86,3.59 C31R.2 | v34.29,5.39 U31N.5 36.54,5.39 C31A.2
  Top 0.762: L31R.2 C31R.2
  Route2 0.508: v34.29,5.39 30.45,5.39 v28.86,3.81
N$2  (via drill 0.25 pad 0.7)
  Top 0.305: U32R.3 U32R.4
  Top 0.508: U32R.4 v16.16,3.81 | v16.16,3.81 16.16,3.59 C32R.2 | v21.59,5.39 U32N.5 23.84,5.39 C32A.2 | v16.16,3.81 16.16,3.68
  Top 0.762: L32R.2 C32R.2
  Route2 0.508: v21.59,5.39 17.75,5.39 v16.16,3.81
N$3
  Top 0.762: LD02-G.A R02L.2
N$4
  Top 0.762: R20F.1 J20F.1
N$13  (via drill 0.25 pad 0.7)
  Top 0.305: U30R.3 U30R.4
  Top 0.508: v152.88,5.39 U30N.5 155.28,5.39 C30A.2 | U30R.4 147.61,3.84 v147.64,3.81 147.64,3.46 147.03,2.86
  Top 0.762: L30R.2 147.03,2.86 C30R.2
  Route15 0.508: v152.88,5.39 149.22,5.39 v147.64,3.81
N$25
  Top 0.762: LD01-G.A R01L.2
N$69
  Top 1.016: T20H.3 H5.1
N$70
  Top 0.762: R20L.2 LD20-R.A
N$85
  Top 0.762: H16.1 R20BL.1
N$86
  Top 0.762: H17.1 R20AL.1
N$87
  Top 0.762: T20A.3 R20AL.2
N$88
  Top 0.762: T20B.3 R20BL.2
N$89
  Top 0.762: T20F.3 J20F.3
N$90
  Top 0.508: D20F.2 J20F.2
N$148
  Top 0.762: LD11-G.A R11L.2
N$149
  Top 0.762: LD10-R.A R10L.2
N$151
  Top 1.27: D01.C Z01.2
N$152
  Top 0.762: LD13G.A R13L.2
N$153
  Top 0.762: LD12R.A R12L.2
N$162
  Top 1.016: Z02.2 Z01.1
RTD30
  Top 0.254: R30C.2 149.38,4.6 150.18,5.39 150.18,6.19 150.34,6.35 U30N.1
  Top 0.508: U30N.1 151.16,9.02 148.75,11.43 145.89,11.43 144.46,12.86 H7.1
RTD31
  Top 0.254: R31C.2 31.43,5.37 31.43,6.19 31.59,6.35 U31N.1
  Top 0.508: U31N.1 32.41,8.12 H11.1
RTD32
  Top 0.254: U32N.1 18.89,6.35 18.73,6.19 18.73,5.37 R32C.2
  Top 0.305: 18.07,4.57 17.94,4.44
  Top 0.508: 18.07,4.57 R32C.2
  Top 0.762: 17.94,4.44 17.93,4.43 H13.1
RXD_232  (via drill 0.25 pad 0.7)
  Top 0.203: U10.9 76.31,2.8 74.61,1.11 64.77,1.11 63.98,1.9 J10S.1
  Top 0.254: v64.61,3.97 v63.34,3.97 63.5,3.97 J10S.1
RXD_485
  Top 0.203: U11.1 103.51,6.35 99.22,6.35 98.74,6.82 83.66,6.82 83.54,6.7 U10.18
  Top 0.305: LD13G.C 103.66,6.5 U11.1
SCL  (via drill 0.25 pad 0.7)
  Top 0.254: R11B.2 75.24,6.7 U10.3 78.54,6.7 78.9,6.35 v78.9,1.59 | v152.56,4.12 151.48,4.12 U30N.3
  Top 0.508: U32N.3 v20.63,4.45 v20.64,4.44 | v33.5,4.44 U31N.3
  Route15 0.254: v20.64,4.44 v33.5,4.44 35.72,4.44 38.89,1.27 78.58,1.27 v78.9,1.59 143.03,1.59 143.67,2.22 150.65,2.22 v152.56,4.12
SDA  (via drill 0.25 pad 0.7)
  Top 0.254: R10B.2 75.09,8.12 75.09,7.94 75.56,7.94 76.15,7.35 U10.2 78.84,7.35 79.85,6.35 v79.85,0.95 | U30N.4 153.96,2.03 v153.83,1.9
  Top 0.508: U32N.4 22.7,4.45 23.02,4.12 v23.02,3.49 | U31N.4 35.24,4.45 v35.24,3.65
  Route15 0.254: v23.02,3.49 23.34,3.81 27.14,3.81 27.94,3.01 34.61,3.01 v35.24,3.65 35.56,3.65 38.58,0.63 79.53,0.63 v79.85,0.95 152.88,0.95 v153.83,1.9
SWD_CLK
  Top 0.203: U10.20 82.77,9.78 82.39,10.16 78.9,10.16 78.58,9.84 78.58,9.27 J10P.3
SWDIO
  Top 0.203: U10.19 82.02,7.35 81,8.37 J10P.1
TXD_232  (via drill 0.25 pad 0.7)
  Top 0.203: U10.8 76.32,3.45 74.45,1.59 66.83,1.59 66.52,1.9 J10S.2
  Top 0.254: v65.88,3.97 66.04,3.97 J10S.2 66.99,3.97 v67.15,3.97
TXD_485
  Top 0.203: U10.17 83.52,6.05 83.82,6.35 97.95,6.35 99.88,4.42 U11.4
  Top 0.305: U11.4 103.66,4.42 LD12R.C
VCC
  Top 0.305: U01.1 122.72,4.76 123.03,5.08 124.3,5.08 124.61,5.39 U01.4 126.05,6.48 R01L.1
  Top 0.508: U01.1 122.72,2.27 C01.1
  Top 0.762: R01L.1 126.52,6.94 126.52,10.36 Z02.1
VCCA
  Top 0.203: U10.5
  Top 0.254: L10.2 74.97,5.4 U10.5 77.3,5.4 77.31,5.39
  Top 0.305: 74.96,5.53 75.09,5.39 L10.2
VDD_3V3  (via drill 0.25 pad 0.7)
  Top 0.254: R02L.1
  Top 0.305: U01.5 121.26,6.48 R02L.1 | C11D.1 v84.3,5.39 84.29,5.4 U10.16 | U11.8 106.33,7.13 R13L.1
  Top 0.508: U01.5 v122.71,7.46 122.71,8.12 C02.1 | L32R.1 | L31R.1 | L30R.1
  Top 0.762: R13L.1 C12D.1 107.18,7.94 v108.11,7.94 | R12L.1 106.49,2.88 v106.52,2.86 | C10D.1 73.31,4.57 v73.34,4.6 73.31,4.63 L10.1 R11B.1 R10B.1 | L32R.1 v13.02,1.59 | L31R.1 v25.72,1.59 | L30R.1 v144.46,1.59
  pour Route2: -0.16,0 -0.16,8.25 180.18,8.25 180.18,2.54 172.24,2.54 172.24,0
VDD_24V  (via drill 0.25 pad 0.7)
  Top 0.305: J10B.A9 138.25,10.32 | 138.25,10.32 138.25,10.21 J10B.B4 138.2,10.09 137.95,9.84 137.95,9.61 J10B.B5 | J10B.A4 135.75,10.32 | 135.75,10.32 135.75,10.21 J10B.B9 135.8,10.09 136.05,9.84 136.05,9.61 J10B.B8 | J11B.A9 44.27,10.47 | 44.27,10.47 44.27,10.21 J11B.B4 44.22,10.09 43.97,9.84 43.97,9.68 43.81,9.52 | J11B.A4 41.77,10.47 | 41.77,10.47 41.77,10.21 J11B.B9 41.82,10.09 42.07,9.84 42.07,9.61 J11B.B8 | J10B.A8 137.75,10.82 138.25,10.32 | J10B.A5 136.25,10.82 135.75,10.32 | J11B.A5 42.27,10.97 41.77,10.47 | J11B.A8 43.77,10.97 44.27,10.47
  Top 0.762: R20F.2 v51.27,7.62
  Top 1.016: D01.A v132.56,14.29
  Route2 0.305: J10B.B9 135.8,10.09 136.05,9.84 136.05,9.61 J10B.B8 | J10B.B4 138.2,10.09 137.95,9.84 137.95,9.68 137.79,9.52
  Route2 0.508: 138.2,11.43 J10B.B4 | J10B.B9 135.8,11.34 | J11B.B9 41.82,11.36 | J11B.B4 44.22,11.36
  Route2 0.762: v51.27,7.62 51.27,9.84
  pour Route2: -0.16,8.73 -0.16,17.46 180.18,17.46 180.18,8.73
VREF30
  Top 0.254: U30R.5 148.56,5.39 R30C.1
  Top 0.508: C30F.2 147.61,7.2 U30R.6 149.26,6.35 R30C.1
VREF31
  Top 0.254: U31R.5 29.82,5.39 R31C.1
  Top 0.508: C31F.2 28.86,7.2 U31R.6 30.51,6.35 R31C.1
VREF32
  Top 0.254: U32R.5 17.12,5.39 R32C.1
  Top 0.508: C32F.2 15.43,7.94 15.4,7.94 16.16,7.17 U32R.6 17.81,6.35 R32C.1

### Text on the board
Top: 1
Route2: 2
Route15: 3
Bottom: 4
tPlace: SimSun PID | 180909-v1.0 | A3 | A1 | A0 | Rx | Tx | GND | + | - | + | PWM | - | -